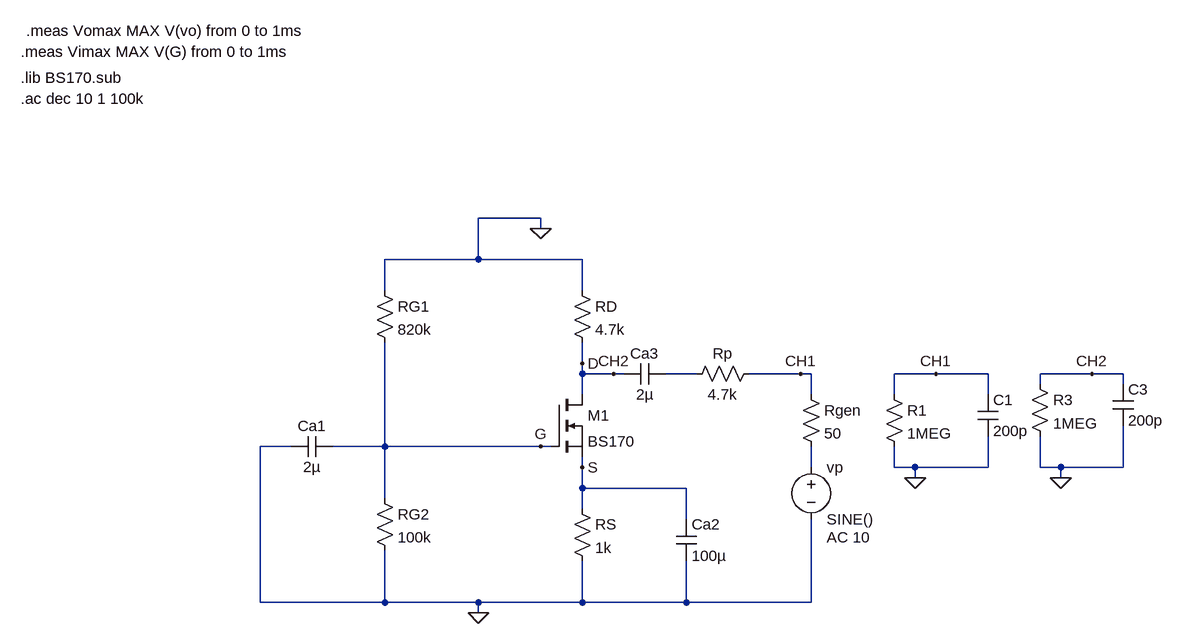
[diagram p0: schematic A.asc]
A.asc, the LTspice schematic file:
Version 4
SHEET 1 1732 680
WIRE 528 -64 432 -64
WIRE 528 -48 528 -64
WIRE 432 0 432 -64
WIRE 432 0 288 0
WIRE 592 0 432 0
WIRE 288 48 288 0
WIRE 592 48 592 0
WIRE 592 160 592 128
WIRE 592 176 592 160
WIRE 640 176 592 176
WIRE 656 176 640 176
WIRE 768 176 720 176
WIRE 928 176 848 176
WIRE 944 176 928 176
WIRE 1136 176 1072 176
WIRE 1216 176 1136 176
WIRE 1376 176 1296 176
WIRE 1424 176 1376 176
WIRE 1296 192 1296 176
WIRE 1424 192 1424 176
WIRE 592 208 592 176
WIRE 944 208 944 176
WIRE 1072 208 1072 176
WIRE 1216 208 1216 176
WIRE 144 288 96 288
WIRE 288 288 288 128
WIRE 288 288 208 288
WIRE 528 288 288 288
WIRE 544 288 528 288
WIRE 592 320 592 304
WIRE 944 320 944 288
WIRE 1072 320 1072 288
WIRE 1104 320 1072 320
WIRE 1216 320 1216 272
WIRE 1216 320 1104 320
WIRE 1296 320 1296 272
WIRE 1328 320 1296 320
WIRE 1424 320 1424 256
WIRE 1424 320 1328 320
WIRE 1104 336 1104 320
WIRE 1328 336 1328 320
WIRE 592 352 592 320
WIRE 752 352 592 352
WIRE 288 368 288 288
WIRE 592 384 592 352
WIRE 752 400 752 352
WIRE 96 528 96 288
WIRE 288 528 288 448
WIRE 288 528 96 528
WIRE 432 528 288 528
WIRE 592 528 592 464
WIRE 592 528 432 528
WIRE 752 528 752 464
WIRE 752 528 592 528
WIRE 944 528 944 400
WIRE 944 528 752 528
WIRE 432 544 432 528
FLAG 432 544 0
FLAG 528 288 G
FLAG 592 160 D
FLAG 592 320 S
FLAG 1104 336 0
FLAG 1328 336 0
FLAG 1136 176 CH1
FLAG 928 176 CH1
FLAG 1376 176 CH2
FLAG 640 176 CH2
FLAG 528 -48 0
SYMBOL res 576 32 R0
SYMATTR InstName RD
SYMATTR Value 4.7k
SYMBOL res 272 32 R0
SYMATTR InstName RG1
SYMATTR Value 820k
SYMBOL res 272 352 R0
SYMATTR InstName RG2
SYMATTR Value 100k
SYMBOL res 576 368 R0
SYMATTR InstName RS
SYMATTR Value 1k
SYMBOL nmos 544 208 R0
SYMATTR InstName M1
SYMATTR Value BS170
SYMBOL cap 736 400 R0
SYMATTR InstName Ca2
SYMATTR Value 100µ
SYMBOL voltage 944 304 R0
WINDOW 123 24 124 Left 2
WINDOW 39 0 0 Left 2
SYMATTR Value2 AC 10
SYMATTR InstName vp
SYMATTR Value SINE()
SYMBOL res 1056 192 R0
SYMATTR InstName R1
SYMATTR Value 1MEG
SYMBOL cap 1200 208 R0
SYMATTR InstName C1
SYMATTR Value 200p
SYMBOL res 928 192 R0
SYMATTR InstName Rgen
SYMATTR Value 50
SYMBOL cap 208 272 R90
WINDOW 0 0 32 VBottom 2
WINDOW 3 32 32 VTop 2
SYMATTR InstName Ca1
SYMATTR Value 2µ
SYMBOL cap 720 160 R90
WINDOW 0 0 32 VBottom 2
WINDOW 3 32 32 VTop 2
SYMATTR InstName Ca3
SYMATTR Value 2µ
SYMBOL res 864 160 R90
WINDOW 0 0 56 VBottom 2
WINDOW 3 32 56 VTop 2
SYMATTR InstName Rp
SYMATTR Value 4.7k
SYMBOL res 1280 176 R0
SYMATTR InstName R3
SYMATTR Value 1MEG
SYMBOL cap 1408 192 R0
SYMATTR InstName C3
SYMATTR Value 200p
TEXT -272 -280 Left 2 !.lib BS170.sub
TEXT -264 -352 Left 2 !.meas Vomax MAX V(vo) from 0 to 1ms
TEXT -272 -320 Left 2 !.meas Vimax MAX V(G) from 0 to 1ms
TEXT -272 -248 Left 2 !.ac dec 10 1 100k

The netlist it stands for:
* A.asc
RD 0 CH2 4.7k
RG1 0 G 820k
RG2 G 0 100k
RS S 0 1k
M1 CH2 G S S BS170
Ca2 S 0 100µ
vp N002 0 SINE() AC 10
R1 CH1 0 1MEG
C1 CH1 0 200p
Rgen CH1 N002 50
Ca1 G 0 2µ
Ca3 N001 CH2 2µ
Rp CH1 N001 4.7k
R3 CH2 0 1MEG
C3 CH2 0 200p
.model NMOS NMOS
.model PMOS PMOS
.lib standard.mos
.lib BS170.sub
.meas Vomax MAX V(vo) from 0 to 1ms
.meas Vimax MAX V(G) from 0 to 1ms
.ac dec 10 1 100k
.backanno
.end

* Results of the author's LTspice run, read from the files saved beside the schematic
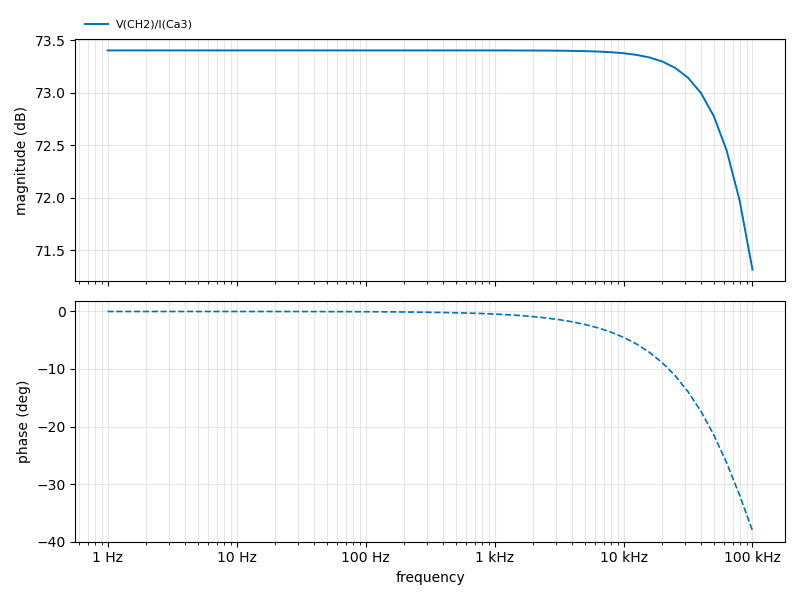
[diagram p1: AC Analysis of A.asc, plotted from the saved traces]
* AC Analysis, 1 run:
*   V(CH2)/I(Ca3): 73.40 dB at 1 Hz, 71.32 dB at 100 kHz, peak 73.40 dB at 1 Hz
* From the log:
*   Measurement "vomax" FAIL'ed
*   vimax: MAX(v(g))=(-117.848dB,-118.139°) FROM 0 TO 0.001